# Altium schematic sheet Digital Input.SchDoc
size A4; SheetNumber: 3; SheetTotal: 6
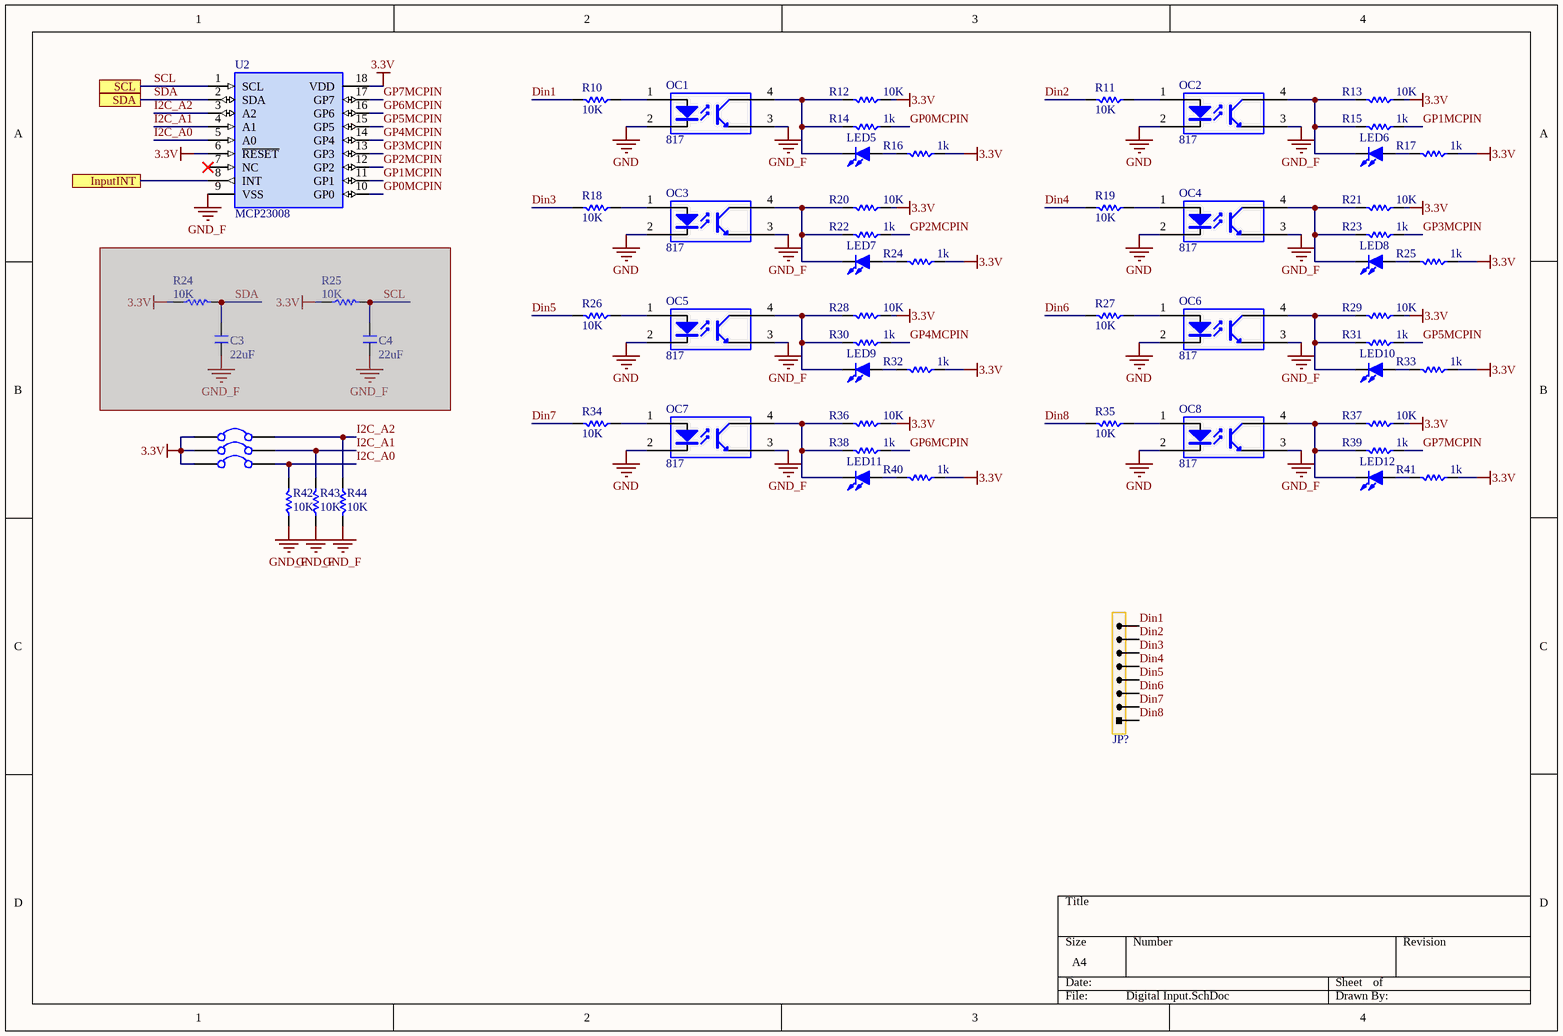
[diagram p0: Digital Input.SchDoc]

## Parts
(Parts that share a designator on the sheet are numbered #1, #2 ... from top to bottom, then left to right.)
C3  22uF  [C 0805]  (masked out: inside a compile mask, not in the netlist)
C4  22uF  [C 0805]  (masked out: inside a compile mask, not in the netlist)
JP?  HDR-1X8  [KF7620-8P]  (value not drawn)
LED5  LED-SMD  [LED 0805B]  (value not drawn)
LED6  LED-SMD  [LED 0805B]  (value not drawn)
LED7  LED-SMD  [LED 0805B]  (value not drawn)
LED8  LED-SMD  [LED 0805B]  (value not drawn)
LED9  LED-SMD  [LED 0805B]  (value not drawn)
LED10  LED-SMD  [LED 0805B]  (value not drawn)
LED11  LED-SMD  [LED 0805B]  (value not drawn)
LED12  LED-SMD  [LED 0805B]  (value not drawn)
OC1  817  [PC817-SMD]
OC2  817  [PC817-SMD]
OC3  817  [PC817-SMD]
OC4  817  [PC817-SMD]
OC5  817  [PC817-SMD]
OC6  817  [PC817-SMD]
OC7  817  [PC817-SMD]
OC8  817  [PC817-SMD]
R10  10K  [R 0805]
R11  10K  [R 0805]
R12  10K  [R 0805]
R13  10K  [R 0805]
R14  1k  [R 0805]
R15  1k  [R 0805]
R16  1k  [R 0805]
R17  1k  [R 0805]
R18  10K  [R 0805]
R19  10K  [R 0805]
R20  10K  [R 0805]
R21  10K  [R 0805]
R22  1k  [R 0805]
R23  1k  [R 0805]
R24#1  1k  [R 0805]
R24#2  10K  [R 0805]  (masked out: inside a compile mask, not in the netlist)
R25#1  1k  [R 0805]
R25#2  10K  [R 0805]  (masked out: inside a compile mask, not in the netlist)
R26  10K  [R 0805]
R27  10K  [R 0805]
R28  10K  [R 0805]
R29  10K  [R 0805]
R30  1k  [R 0805]
R31  1k  [R 0805]
R32  1k  [R 0805]
R33  1k  [R 0805]
R34  10K  [R 0805]
R35  10K  [R 0805]
R36  10K  [R 0805]
R37  10K  [R 0805]
R38  1k  [R 0805]
R39  1k  [R 0805]
R40  1k  [R 0805]
R41  1k  [R 0805]
R42  10K  [R 0805]
R43  10K  [R 0805]
R44  10K  [R 0805]
SB1  Solder Bridge  [Solder Bridge Open]  (value not drawn)
SB2  Solder Bridge  [Solder Bridge Open]  (value not drawn)
SB3  Solder Bridge  [Solder Bridge Open]  (value not drawn)
U2  MCP23008  [SOP18W_M]

## Ports
InputINT, SCL, SDA

## Nets
3.3V: R12.1 R13.1 R16.1 R17.1 R20.1 R21.1 R24#1.1 R25#1.1 R28.1 R29.1 R32.1 R33.1 R36.1 R37.1 R40.1 R41.1 SB1.1 SB2.1 SB3.1 U2.6(~{RESET}) U2.18(VDD)
GND: OC1.2(K) OC2.2(K) OC3.2(K) OC4.2(K) OC5.2(K) OC6.2(K) OC7.2(K) OC8.2(K)
GND_F: OC1.3(E) OC2.3(E) OC3.3(E) OC4.3(E) OC5.3(E) OC6.3(E) OC7.3(E) OC8.3(E) R42.1 R43.1 R44.2 U2.9(VSS)
Din1: JP?.8 R10.2
Din2: JP?.7 R11.2
Din3: JP?.6 R18.2
Din4: JP?.5 R19.2
Din5: JP?.4 R26.2
Din6: JP?.3 R27.2
Din7: JP?.2 R34.2
Din8: JP?.1 R35.2
GP0MCPIN: R14.1 U2.10(GP0)
GP1MCPIN: R15.1 U2.11(GP1)
GP2MCPIN: R22.1 U2.12(GP2)
GP3MCPIN: R23.1 U2.13(GP3)
GP4MCPIN: R30.1 U2.14(GP4)
GP5MCPIN: R31.1 U2.15(GP5)
GP6MCPIN: R38.1 U2.16(GP6)
GP7MCPIN: R39.1 U2.17(GP7)
I2C_A0: R42.2 SB3.2 U2.5(A0)
I2C_A1: R43.2 SB2.2 U2.4(A1)
I2C_A2: R44.1 SB1.2 U2.3(A2)
InputINT: U2.8(INT) ; port InputINT
SCL: U2.1(SCL) ; port SCL
SDA: U2.2(SDA) ; port SDA
NetLED5_1: LED5.1(A) R16.2
NetLED5_2: LED5.2(K) OC1.4(C) R12.2 R14.2
NetLED6_1: LED6.1(A) R17.2
NetLED6_2: LED6.2(K) OC2.4(C) R13.2 R15.2
NetLED7_1: LED7.1(A) R24#1.2
NetLED7_2: LED7.2(K) OC3.4(C) R20.2 R22.2
NetLED8_1: LED8.1(A) R25#1.2
NetLED8_2: LED8.2(K) OC4.4(C) R21.2 R23.2
NetLED9_1: LED9.1(A) R32.2
NetLED9_2: LED9.2(K) OC5.4(C) R28.2 R30.2
NetLED10_1: LED10.1(A) R33.2
NetLED10_2: LED10.2(K) OC6.4(C) R29.2 R31.2
NetLED11_1: LED11.1(A) R40.2
NetLED11_2: LED11.2(K) OC7.4(C) R36.2 R38.2
NetLED12_1: LED12.1(A) R41.2
NetLED12_2: LED12.2(K) OC8.4(C) R37.2 R39.2
NetOC1_1: OC1.1(A) R10.1
NetOC2_1: OC2.1(A) R11.1
NetOC3_1: OC3.1(A) R18.1
NetOC4_1: OC4.1(A) R19.1
NetOC5_1: OC5.1(A) R26.1
NetOC6_1: OC6.1(A) R27.1
NetOC7_1: OC7.1(A) R34.1
NetOC8_1: OC8.1(A) R35.1

Not connected (* = marked no-connect by the designer): U2 7(NC)*

## Library data of the parts
C3 C4 = C: Non-polar patch capacitor; BOM名称: 无极性贴片电容; 版权归属: 源创客; 学习资源: www.ooocke.com
JP? = Header 8: 8P Connector; BOM名称: 8P接插件; 版权归属: 源创客; 学习资源: www.ooocke.com
LED5-LED12 = LED-SMD: Patch LED; BOM名称: 贴片LED; 版权归属: 源创客; 学习资源: www.ooocke.com
OC1-OC8 = 817: AC Input Photocoupler; BOM名称: 线性光耦; 版权归属: 源创客; 学习资源: www.ooocke.com
R10-R23 R24#1 R24#2 R25#1 R25#2 R26-R44 = R: Chip resistor; 版权归属: 源创客; BOM名称: Chip resistor; 学习资源: www.ooocke.com
U2 = MCP23008: 8 Bit I/O Expander